# Altium schematic sheet Analog_IOs.SCHDOC: Evaluation Board 3.2
size A3; Organization: Toradex AG; Address1: Altsagenstrasse 5; Address2: Horw; Address3: 6048; Address4: Switzerland; DocumentNumber: 11; Revision: V3.2; SheetNumber: 11; SheetTotal: 23; PageSetup: Record=PageOptions|CenterHorizontal=True|CenterVertical=True|PrintScale=0.73|XCorrection=1.00|YCorrection=1.00|PrintKind=0|BorderSize=5000000|LeftOffset=0|BottomOffset=0|Orientation=2|PaperLength=1000|PaperWidth=1000|Scale=100|PaperSource=7|PrintQuality=-4|MediaType=1|DitherType=10|PaperKind=A4|PrintScaleMode=1
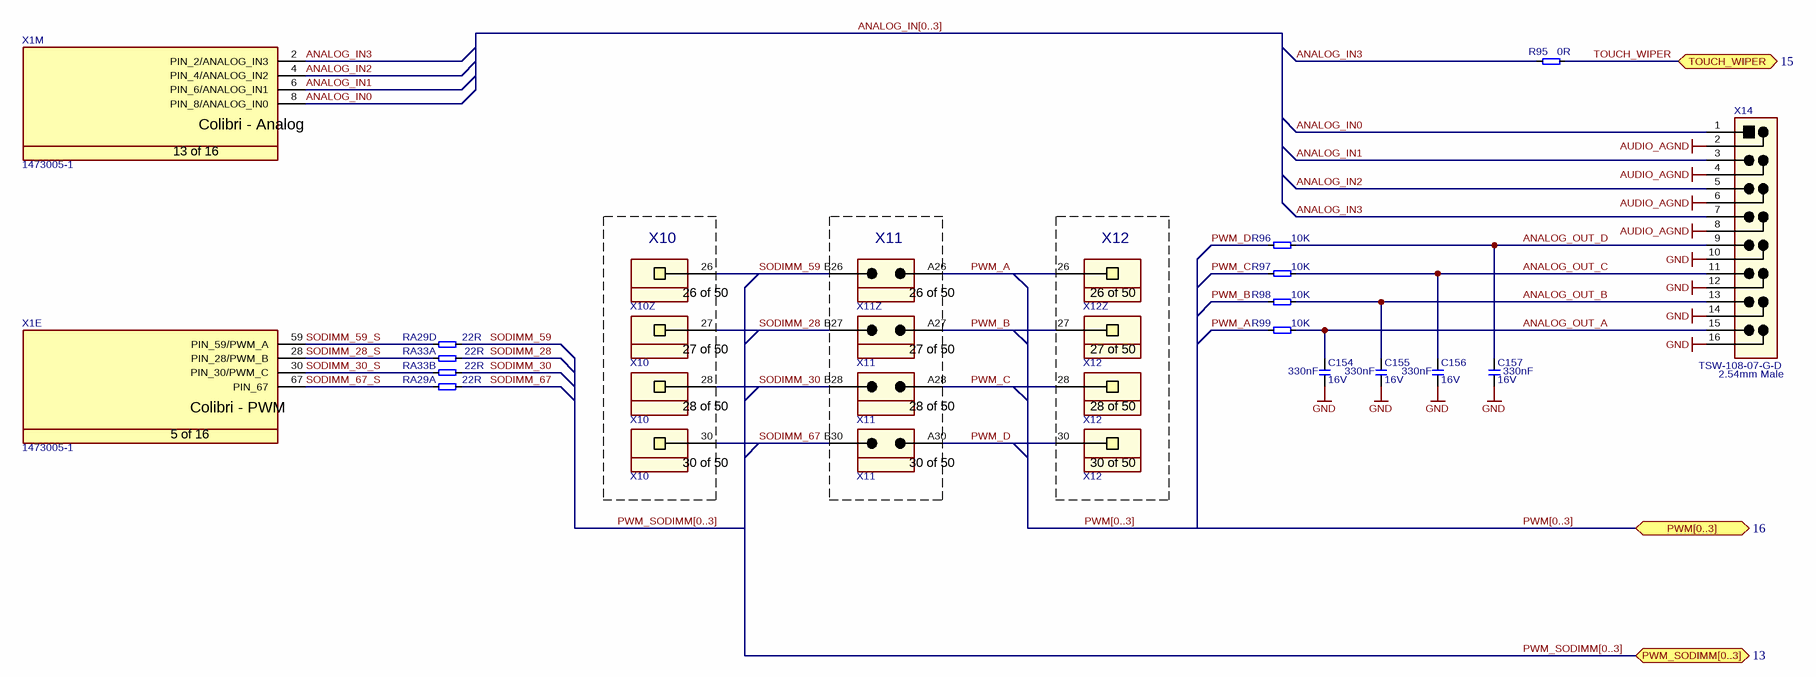
[diagram p0: Analog_IOs.SCHDOC]

## Parts
C154  Rating: 16V  [T_CAPC0805X125N]  (hidden comment: 330nF)
C155  Rating: 16V  [T_CAPC0805X125N]  (hidden comment: 330nF)
C156  Rating: 16V  [T_CAPC0805X125N]  (hidden comment: 330nF)
C157  Rating: 16V  [T_CAPC0805X125N]  (hidden comment: 330nF)
R95  0R  [T_RESC0603X30N]
R96  10K  [T_RESC0603X30N]
R97  10K  [T_RESC0603X30N]
R98  10K  [T_RESC0603X30N]
R99  10K  [T_RESC0603X30N]
RA29  22R  [T_Resistor_Array_X4]  (parts A,D of 4)
RA33  22R  [T_Resistor_Array_X4]  (parts A,B of 4)
X1  Manufacturer Part No.: 1473005-1  [T_Tyco_1473005-1]  (hidden comment: CON-Tyco-1473005-1-200-0.6mm)  (parts E,M of 16)
X10  SSW-110-01-G-S  [T_Samtec_SSW-110-01-G-S]  (value not drawn)  (parts Z,27,28,30 of 50)
X11  TSW-110-07-G-D  [T_Samtec_TSW-110-07-G-D]  (value not drawn)  (parts Z,27,28,30 of 50)
X12  SSW-110-01-G-S  [T_Samtec_SSW-110-01-G-S]  (value not drawn)  (parts Z,27,28,30 of 50)
X14  TSW-108-07-G-D  [T_Samtec_TSW-108-07-G-D]

## Blocks framed on the sheet
X10: X10
X11: X11
X12: X12

## Ports
PWM[0..3] (bidir, see 16), PWM_SODIMM[0..3] (bidir, see 13), TOUCH_WIPER (bidir, see 15)

## Nets
AUDIO_AGND: X14.2 X14.4 X14.6 X14.8
GND: C154.1 C155.1 C156.1 C157.1 X14.10 X14.12 X14.14 X14.16
ANALOG_IN0: X1.8(PIN_8/ANALOG_IN0) X14.1
ANALOG_IN1: X1.6(PIN_6/ANALOG_IN1) X14.3
ANALOG_IN2: X1.4(PIN_4/ANALOG_IN2) X14.5
ANALOG_IN3: R95.1 X1.2(PIN_2/ANALOG_IN3) X14.7
ANALOG_OUT_A: C154.2 R99.2 X14.15
ANALOG_OUT_B: C155.2 R98.2 X14.13
ANALOG_OUT_C: C156.2 R97.2 X14.11
ANALOG_OUT_D: C157.2 R96.2 X14.9
PWM_A: R99.1 X11.A26 X12.26
PWM_B: R98.1 X11.A27 X12.27
PWM_C: R97.1 X11.A28 X12.28
PWM_D: R96.1 X11.A30 X12.30
SODIMM_28: RA33.5 X10.27 X11.B27
SODIMM_28_S: RA33.1 X1.28(PIN_28/PWM_B)
SODIMM_30: RA33.6 X10.28 X11.B28
SODIMM_30_S: RA33.2 X1.30(PIN_30/PWM_C)
SODIMM_59: RA29.8 X10.26 X11.B26
SODIMM_59_S: RA29.4 X1.59(PIN_59/PWM_A)
SODIMM_67: RA29.5 X10.30 X11.B30
SODIMM_67_S: RA29.1 X1.67(PIN_67)
TOUCH_WIPER: R95.2 ; port TOUCH_WIPER

## Buses and harness runs
bus ANALOG_IN[0..3]
bus PWM[0..3] = port PWM[0..3]
bus PWM_SODIMM[0..3] = port PWM_SODIMM[0..3]

## Notes on the sheet
- (near X14) 2.54mm Male
- Title
- Size:
- Date:
- A3
- Number:
- Time:
- Revision:
- Sheet
- of
- File:
- (in symbol CON-Samtec-SSW-110-01-G-S, part Z) 26 of 50
- (in symbol CON-Samtec-SSW-110-01-G-S, part 27) 27 of 50
- (in symbol CON-Samtec-SSW-110-01-G-S, part 28) 28 of 50
- (in symbol CON-Samtec-SSW-110-01-G-S, part 30) 30 of 50
- (in symbol CON-Samtec-TSW-110-07-G-D, part Z) 26 of 50
- (in symbol CON-Samtec-TSW-110-07-G-D, part 27) 27 of 50
- (in symbol CON-Samtec-TSW-110-07-G-D, part 28) 28 of 50
- (in symbol CON-Samtec-TSW-110-07-G-D, part 30) 30 of 50
- (in symbol CON-Tyco-1473005-1-200-0.6mm, part E) Colibri - PWM; 5 of 16
- (in symbol CON-Tyco-1473005-1-200-0.6mm, part M) Colibri - Analog; 13 of 16

## Library data of the parts
C154-C157 = C-X7R-330nF-16V-10%-0805: Capacitor Ceramic X7R 330nF 16V 10% 0805; Tolerance: 10%; Type: X7R; Value: 330nF
R95 = R-0R-63mW-1%-0603: Resistor 0 ohm 63mW 1% 0603; Rating: 63mW; Tolerance: 1%; Value: 0R
R96-R99 = R-10KR-63mW-5%-0603: Resistor 10 Kohm 63mW 5% 0603; Value: 10KR; Rating: 63mW; Tolerance: 5%
RA29 RA33 = RA-22R-63mW-5%-1206-div: Resistor Array 22 R 63mW 5% 1206; Tolerance: 5%; Power Dissipation: 63mW; Value: 22R
X1 = CON-Tyco-1473005-1-200-0.6mm: SODIMM Connector; Manufacturer Name: Tyco; No. of ways: 200
X10 X12 = CON-Samtec-SSW-110-01-G-S: Header 1x50 pin 2.54mm pitch; Manufacturer Name: Samtec; Pitch: 2.54mm; No. of ways: 1x50; Manufacturer Part No.: SSW-110-01-G-S
X11 = CON-Samtec-TSW-110-07-G-D: Header 2x50 pin 2.54mm pitch; Manufacturer Name: Samtec; Pitch: 2.54mm; No. of ways: 2x50; Manufacturer Part No.: TSW-110-07-G-D
X14 = CON-Samtec-TSW-108-07-G-D: Header Male, 2x8 Pins, 2.54mm pitch; Manufacturer Name: Samtec; No. of ways: 2x8; Pitch: 2.54mm; Manufacturer Part No.: TSW-108-07-G-D